# Altium schematic sheet Power.SchDoc
size A
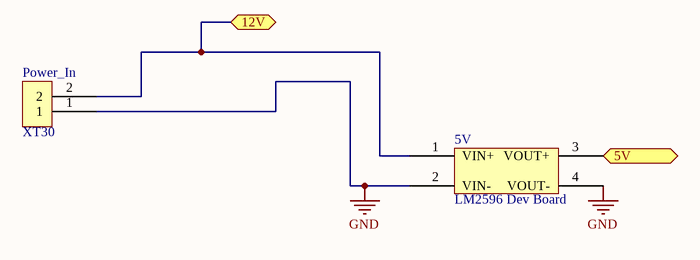
[diagram p0: Power.SchDoc]

## Parts
5V  LM2596 Dev Board  [PCB-au5pcc3dbfiberwxa7uf-1]
Power_In  XT30  [PCB-8h6goupi0sbkduz6cbnu-1]

## Ports
5V, 12V

## Nets
GND: 5V.2(VIN-) 5V.4(VOUT-) Power_In.1
5V: 5V.3(VOUT+) ; port 5V
12V: 5V.1(VIN+) Power_In.2 ; port 12V

## Library data of the parts
5V = CMP-rk5etthe7j20p4ul5f5d-2: LM2596 Buck converter on one of the cheap boards you can buy from Ebay, Amazon, Aliexpress, etc; CustomComponentID: rk5etthe7j20p4ul5f5d
Power_In = CMP-nlx8yci0umf6n9sk0ty3-1: Very similar to the XT60 models, but smaller and made for 30A; Homepage URL: https://www.amazon.com/ProgressiveRC-AC-XT30-XT30-Connectors-pairs/dp/B011WDZGM0; CustomComponentID: nlx8yci0umf6n9sk0ty3